# Altium schematic sheet main.SchDoc
size A4
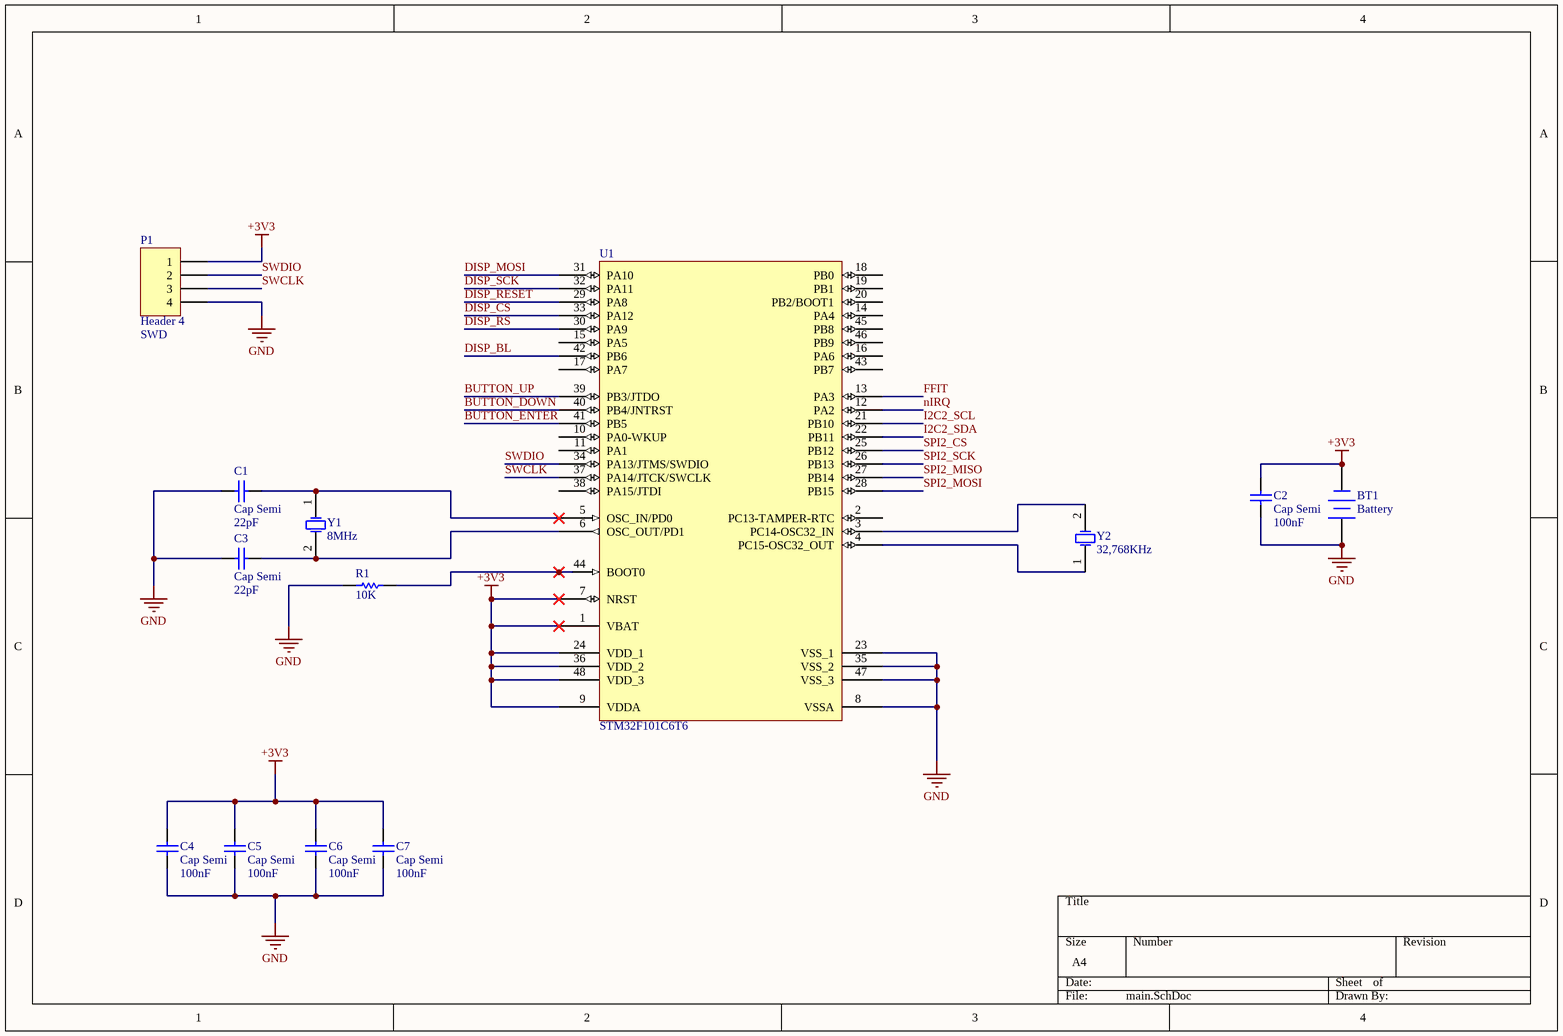
[diagram p0: main.SchDoc]

## Parts
BT1  Battery  [BAT-2]
C1  Cap Semi  value 22pF  [CAPC3216L]
C2  Cap Semi  value 100nF  [CAPC3216L]
C3  Cap Semi  value 22pF  [CAPC3216L]
C4  Cap Semi  value 100nF  [CAPC3216L]
C5  Cap Semi  value 100nF  [CAPC3216L]
C6  Cap Semi  value 100nF  [CAPC3216L]
C7  Cap Semi  value 100nF  [CAPC3216L]
P1  Header 4  Comment_1: SWD  [HDR1X4]
R1  value 10K  [RESC2012L]  (hidden comment: Res Semi)
U1  STM32F101C6T6  [LQFP48_L]
Y1  8MHz  [HC-49U]
Y2  32,768KHz  [BCY-W2/D3.1]

## Nets
+3V3: BT1.2(-) C2.2 C4.2 C5.2 C6.2 C7.2 P1.1 U1.1(VBAT) U1.7(NRST) U1.9(VDDA) U1.24(VDD_1) U1.36(VDD_2) U1.48(VDD_3)
GND: BT1.1(+) C1.2 C2.1 C3.2 C4.1 C5.1 C6.1 C7.1 P1.4 R1.2 U1.8(VSSA) U1.23(VSS_1) U1.35(VSS_2) U1.47(VSS_3)
BUTTON_DOWN: U1.40(PB4/JNTRST)
BUTTON_ENTER: U1.41(PB5)
BUTTON_UP: U1.39(PB3/JTDO)
DISP_BL: U1.42(PB6)
DISP_CS: U1.33(PA12)
DISP_MOSI: U1.31(PA10)
DISP_RESET: U1.29(PA8)
DISP_RS: U1.30(PA9)
DISP_SCK: U1.32(PA11)
FFIT: U1.13(PA3)
I2C2_SCL: U1.21(PB10)
I2C2_SDA: U1.22(PB11)
nIRQ: U1.12(PA2)
SPI2_CS: U1.25(PB12)
SPI2_MISO: U1.27(PB14)
SPI2_MOSI: U1.28(PB15)
SPI2_SCK: U1.26(PB13)
SWCLK: P1.3 U1.37(PA14/JTCK/SWCLK)
SWDIO: P1.2 U1.34(PA13/JTMS/SWDIO)
NetC1_1: C1.1 U1.5(OSC_IN/PD0) Y1.1(OSC1)
NetC3_1: C3.1 U1.6(OSC_OUT/PD1) Y1.2(OSC2)
NetR1_1: R1.1 U1.44(BOOT0)
NetU1_3: U1.3(PC14-OSC32_IN) Y2.2(OSC2)
NetU1_4: U1.4(PC15-OSC32_OUT) Y2.1(OSC1)

Not connected (* = marked no-connect by the designer): U1 2(PC13-TAMPER-RTC) 10(PA0-WKUP) 11(PA1) 14(PA4) 15(PA5) 16(PA6) 17(PA7) 18(PB0) 19(PB1) 20(PB2/BOOT1) 38(PA15/JTDI) 43(PB7) 45(PB8) 46(PB9)

## Library data of the parts
BT1 = Battery: Multicell Battery; Published: 24-Mar-1999; LatestRevisionDate: 17-Jul-2002; LatestRevisionNote: Re-released for DXP Platform.; PackageReference: BAT-2; Publisher: Altium Limited
C1-C7 = Cap Semi: Capacitor (Semiconductor SIM Model); Published: 8-Jun-2000; LatestRevisionDate: 29-May-2009; LatestRevisionNote: IPC-7351 Footprint Added.; PackageReference: C1206; Publisher: Altium Limited; PackageDescription: Chip Capacitor
P1 = Header 4: Header, 4-Pin; LatestRevisionDate: 17-Jul-2002; LatestRevisionNote: Re-released for DXP Platform.; Publisher: Altium Limited
R1 = Res Semi: Semiconductor Resistor; Published: 8-Jun-2000; LatestRevisionDate: 17-Jul-2002; LatestRevisionNote: Re-released for DXP Platform.; PackageReference: AXIAL-0.5; Publisher: Altium Limited
U1 = STM32F101C6T6: STM32 ARM-based 32-bit MCU with 32 Kbytes Flash, 48-pin LQFP, Industrial Temperature; Published: 30-May-2008; DatasheetVersion: rev6, Mar-2008; PackageVersion: Mar-2008; PackageReference: LQFP48; Publisher: Altium Limited; PackageDescription: 48-Pin Low-Profile Quad Flat Pack, 7 x 7 mm Body, 0.5 mm Pitch (LQFP48); ComponentLink1Description: Manufacturer Link; ComponentLink1URL: www.st.com/stm32; ComponentLink2Description: Datasheet; ComponentLink2URL: http://www.st.com/stonline/products/literature/ds/13586.pdf
Y1 = ECS-10-13-1: Crystal Oscillator; Published: 17-Jul-2002; DatasheetDocument: 18-Apr-2000; PackageReference: HC-49U; Publisher: Altium Limited; ComponentLink1Description: Manufacturer Link; ComponentLink1URL: http://www.ecsxtal.com/; ComponentLink2Description: Datasheet; ComponentLink2URL: http://www.ecsxtal.com/pdf2/HC49U.PDF
Y2 = XTAL: Crystal Oscillator; Published: 8-Jun-2000; LatestRevisionDate: 17-Jul-2002; LatestRevisionNote: Re-released for DXP Platform.; PackageReference: R38; Publisher: Altium Limited